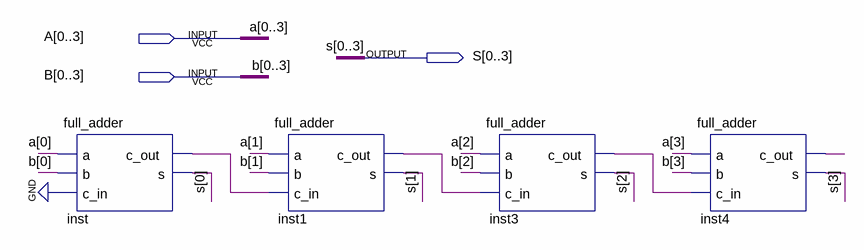
[diagram p0: schematic sheet]
// Quartus schematic adder_4bits.bdf as structural Verilog: 4 symbols, 3 pins
module adder_4bits (
  input  [0:3] A,
  input  [0:3] B,
  output [0:3] S
);

  wire inst1_c_out, inst3_c_out, inst4_c_out, inst_c_out;

  full_adder inst (.a(A[0]), .b(B[0]), .c_in(1'b0), .c_out(inst_c_out), .s(S[0]));
  full_adder inst1 (.a(A[1]), .b(B[1]), .c_in(inst_c_out), .c_out(inst1_c_out), .s(S[1]));
  full_adder inst3 (.a(A[2]), .b(B[2]), .c_in(inst1_c_out), .c_out(inst3_c_out), .s(S[2]));
  full_adder inst4 (.a(A[3]), .b(B[3]), .c_in(inst3_c_out), .c_out(inst4_c_out), .s(S[3]));
endmodule
